# EAGLE design main (EAGLE 5.06)

## Sheet 1 of 3
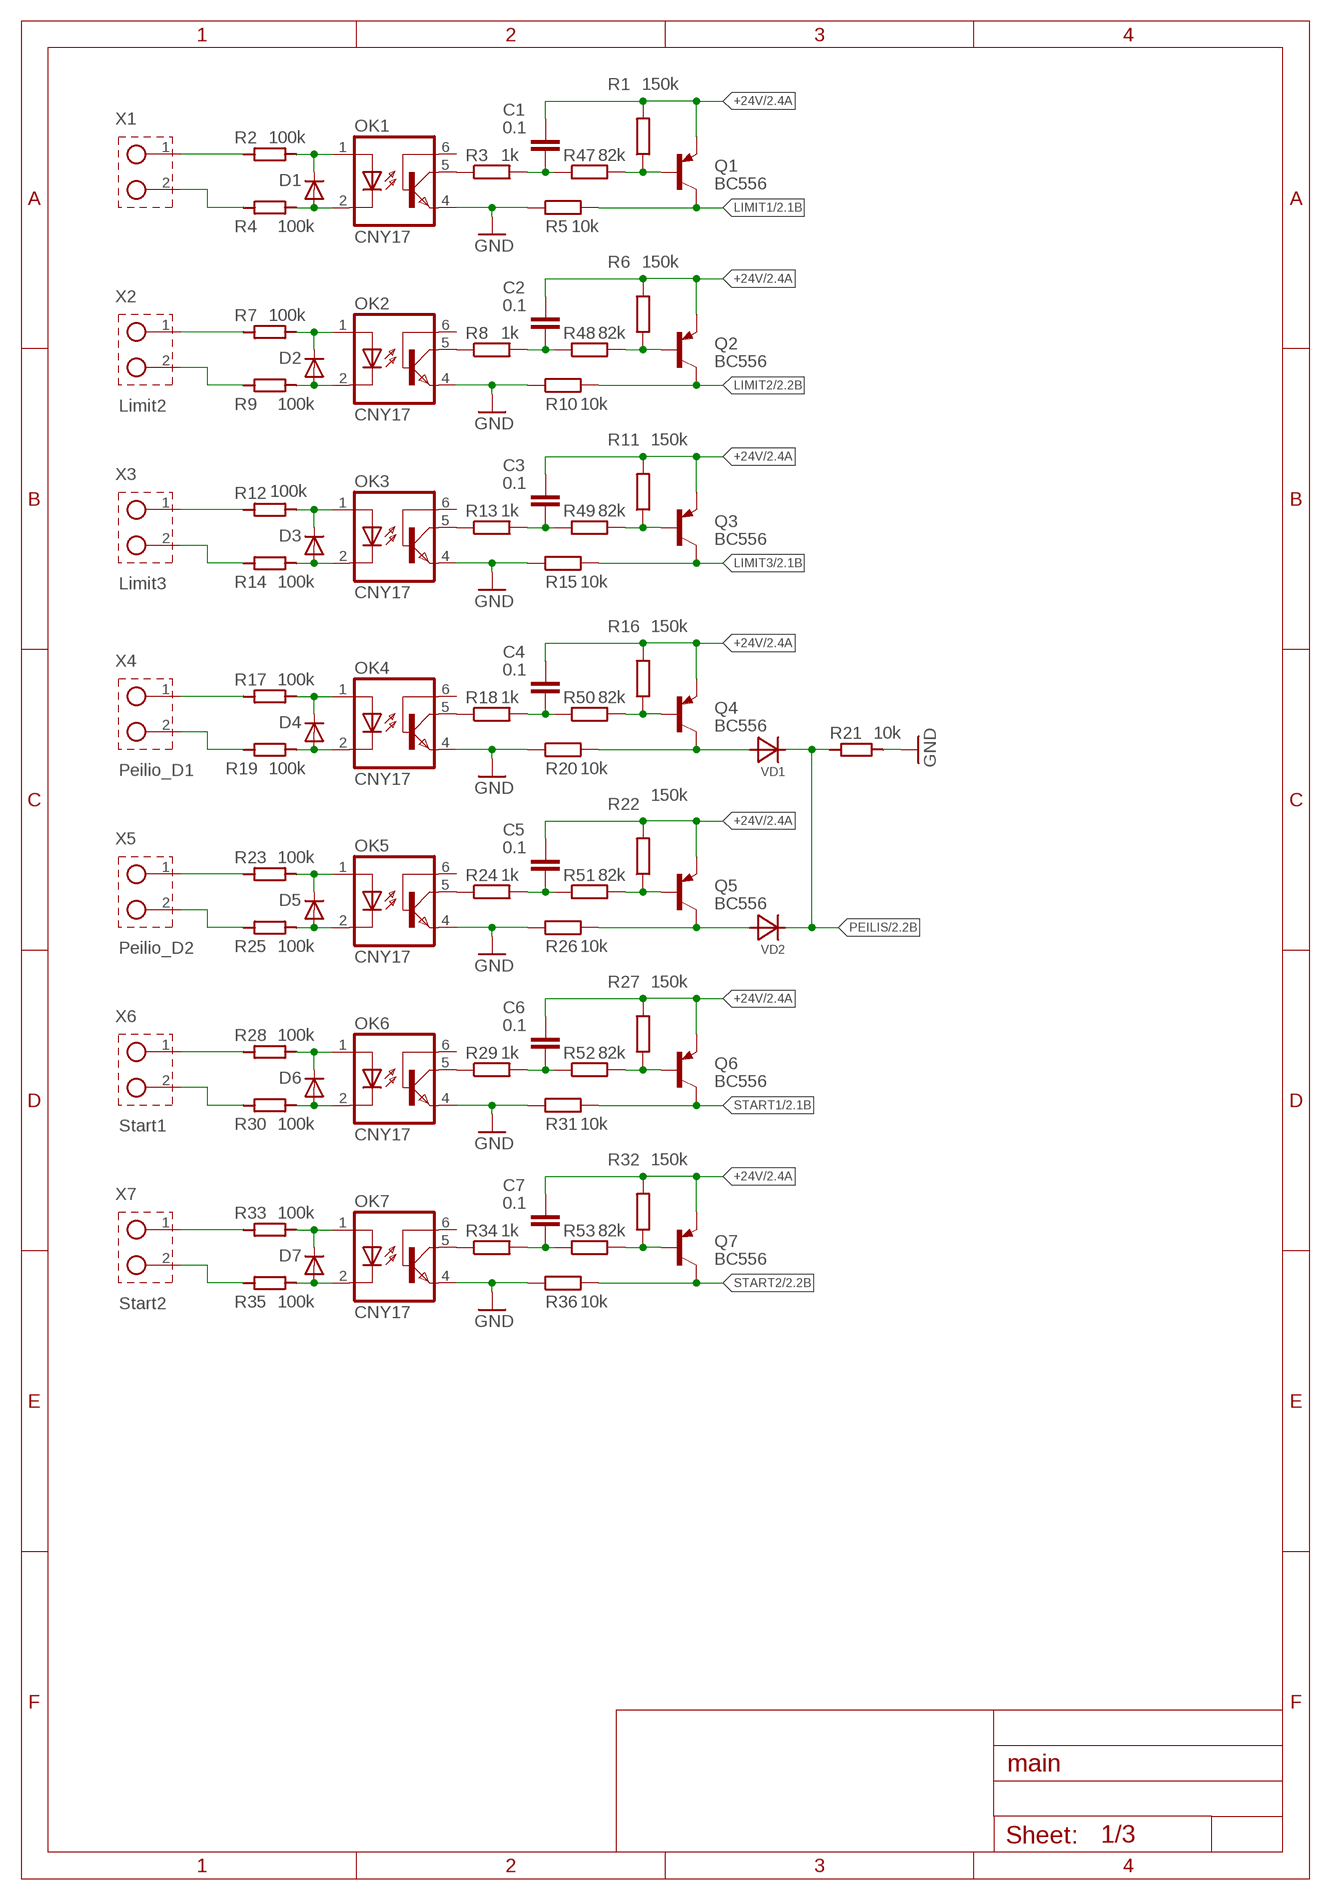
[diagram p0: schematic, sheet 1]

### Parts
C1  0.1  C-EUC0805  [C0805]
C2  0.1  C-EUC0805  [C0805]
C3  0.1  C-EUC0805  [C0805]
C4  0.1  C-EUC0805  [C0805]
C5  0.1  C-EUC0805  [C0805]
C6  0.1  C-EUC0805  [C0805]
C7  0.1  C-EUC0805  [C0805]
D1  1N4148DO35-7  DIODE-MINIMELF  [MINIMELF]
D2  1N4148DO35-7  DIODE-MINIMELF  [MINIMELF]
D3  1N4148DO35-7  DIODE-MINIMELF  [MINIMELF]
D4  1N4148DO35-7  DIODE-MINIMELF  [MINIMELF]
D5  1N4148DO35-7  DIODE-MINIMELF  [MINIMELF]
D6  1N4148DO35-7  DIODE-MINIMELF  [MINIMELF]
D7  1N4148DO35-7  DIODE-MINIMELF  [MINIMELF]
OK1  CNY17  [DIL06]
OK2  CNY17  [DIL06]
OK3  CNY17  [DIL06]
OK4  CNY17  [DIL06]
OK5  CNY17  [DIL06]
OK6  CNY17  [DIL06]
OK7  CNY17  [DIL06]
Q1  BC556  [TO92-EBC]
Q2  BC556  [TO92-EBC]
Q3  BC556  [TO92-EBC]
Q4  BC556  [TO92-EBC]
Q5  BC556  [TO92-EBC]
Q6  BC556  [TO92-EBC]
Q7  BC556  [TO92-EBC]
R1  150k  R-EU_R0805  [R0805]
R2  100k  RESISTOR0207/7  [0207/7]
R3  1k  R-EU_R0805  [R0805]
R4  100k  RESISTOR0207/7  [0207/7]
R5  10k  R-EU_R0805  [R0805]
R6  150k  R-EU_R0805  [R0805]
R7  100k  RESISTOR0207/7  [0207/7]
R8  1k  R-EU_R0805  [R0805]
R9  100k  RESISTOR0207/7  [0207/7]
R10  10k  R-EU_M0805  [M0805]
R11  150k  R-EU_R0805  [R0805]
R12  100k  RESISTOR0207/7  [0207/7]
R13  1k  R-EU_R0805  [R0805]
R14  100k  RESISTOR0207/7  [0207/7]
R15  10k  R-EU_R0805  [R0805]
R16  150k  R-EU_R0805  [R0805]
R17  100k  RESISTOR0207/7  [0207/7]
R18  1k  R-EU_R0805  [R0805]
R19  100k  RESISTOR0207/7  [0207/7]
R20  10k  R-EU_R0805  [R0805]
R21  10k  RESISTOR0805  [R0805]
R22  150k  R-EU_R0805  [R0805]
R23  100k  RESISTOR0207/7  [0207/7]
R24  1k  R-EU_R0805  [R0805]
R25  100k  RESISTOR0207/7  [0207/7]
R26  10k  R-EU_R0805  [R0805]
R27  150k  R-EU_R0805  [R0805]
R28  100k  RESISTOR0207/7  [0207/7]
R29  1k  R-EU_R0805  [R0805]
R30  100k  RESISTOR0207/7  [0207/7]
R31  10k  R-EU_R0805  [R0805]
R32  150k  R-EU_R0805  [R0805]
R33  100k  RESISTOR0207/7  [0207/7]
R34  1k  R-EU_R0805  [R0805]
R35  100k  RESISTOR0207/7  [0207/7]
R36  10k  R-EU_R0805  [R0805]
R47  82k  R-EU_M0805  [M0805]
R48  82k  R-EU_M0805  [M0805]
R49  82k  R-EU_M0805  [M0805]
R50  82k  R-EU_M0805  [M0805]
R51  82k  R-EU_M0805  [M0805]
R52  82k  R-EU_M0805  [M0805]
R53  82k  R-EU_M0805  [M0805]
VD1  DIODE_MINIMELF  [MINIMELF]
VD2  DIODE_MINIMELF  [MINIMELF]
X1  CONN-X2-W237  [W237-2]
X2  Limit2  CONN-X2-W237  [W237-2]
X3  Limit3  CONN-X2-W237  [W237-2]
X4  Peilio_D1  CONN-X2-W237  [W237-2]
X5  Peilio_D2  CONN-X2-W237  [W237-2]
X6  Start1  CONN-X2-W237  [W237-2]
X7  Start2  CONN-X2-W237  [W237-2]

### Nets
+24V: C1.1 C2.1 C3.1 C4.1 C5.1 C6.1 C7.1 Q1.E Q2.E Q3.E Q4.E Q5.E Q6.E Q7.E R1.2 R6.2 R11.2 R16.2 R22.2 R27.2 R32.2 ; also sheet 2,3
/IN1: R4.1 X1.2
/IN2: R9.1 X2.2
/IN3: R14.1 X3.2
/IN4: R19.1 X4.2
/IN5: R25.1 X5.2
/IN6: R30.1 X6.2
/IN7: R35.1 X7.2
GND: OK1.4(EMI) OK2.4(EMI) OK3.4(EMI) OK4.4(EMI) OK5.4(EMI) OK6.4(EMI) OK7.4(EMI) R5.1 R10.1 R15.1 R20.1 R21.1 R26.1 R31.1 R36.1 ; also sheet 2,3
IN1: R2.1 X1.1
IN2: R7.1 X2.1
IN3: R12.1 X3.1
IN4: R17.1 X4.1
IN5: R23.1 X5.1
IN6: R28.1 X6.1
IN7: R33.1 X7.1
LIMIT1: Q1.C R5.2 ; also sheet 2
LIMIT2: Q2.C R10.2 ; also sheet 2
LIMIT3: Q3.C R15.2 ; also sheet 2
N$1: D1.C OK1.1(A) R2.2
N$2: D2.C OK2.1(A) R7.2
N$3: OK1.5(COL) R3.1
N$4: D5.C OK5.1(A) R23.2
N$5: OK2.5(COL) R8.1
N$6: Q1.B R1.1 R47.2
N$7: Q2.B R6.1 R48.2
N$8: D3.C OK3.1(A) R12.2
N$9: OK3.5(COL) R13.1
N$10: Q3.B R11.1 R49.2
N$11: D4.C OK4.1(A) R17.2
N$12: OK4.5(COL) R18.1
N$13: Q4.B R16.1 R50.2
N$14: OK5.5(COL) R24.1
N$15: Q5.B R22.1 R51.2
N$37: D6.C OK6.1(A) R28.2
N$38: OK6.5(COL) R29.1
N$39: Q6.B R27.1 R52.2
N$40: D7.C OK7.1(A) R33.2
N$41: OK7.5(COL) R34.1
N$42: Q7.B R32.1 R53.2
N$55: D1.A OK1.2(C) R4.2
N$56: D2.A OK2.2(C) R9.2
N$57: D3.A OK3.2(C) R14.2
N$58: D4.A OK4.2(C) R19.2
N$59: D5.A OK5.2(C) R25.2
N$60: D6.A OK6.2(C) R30.2
N$61: D7.A OK7.2(C) R35.2
N$62: C1.2 R3.2 R47.1
N$63: C2.2 R8.2 R48.1
N$64: C3.2 R13.2 R49.1
N$65: C4.2 R18.2 R50.1
N$66: C6.2 R29.2 R52.1
N$67: C5.2 R24.2 R51.1
N$68: C7.2 R34.2 R53.1
PEILIO_D1: Q4.C R20.2 VD1.A
PEILIO_D2: Q5.C R26.2 VD2.A
PEILIS: R21.2 VD1.C(K) VD2.C(K) ; also sheet 2
START1: Q6.C R31.2 ; also sheet 2
START2: Q7.C R36.2 ; also sheet 2
Unconnected: OK1.6(BAS) OK2.6(BAS) OK3.6(BAS) OK4.6(BAS) OK5.6(BAS) OK6.6(BAS) OK7.6(BAS)

## Sheet 2 of 3
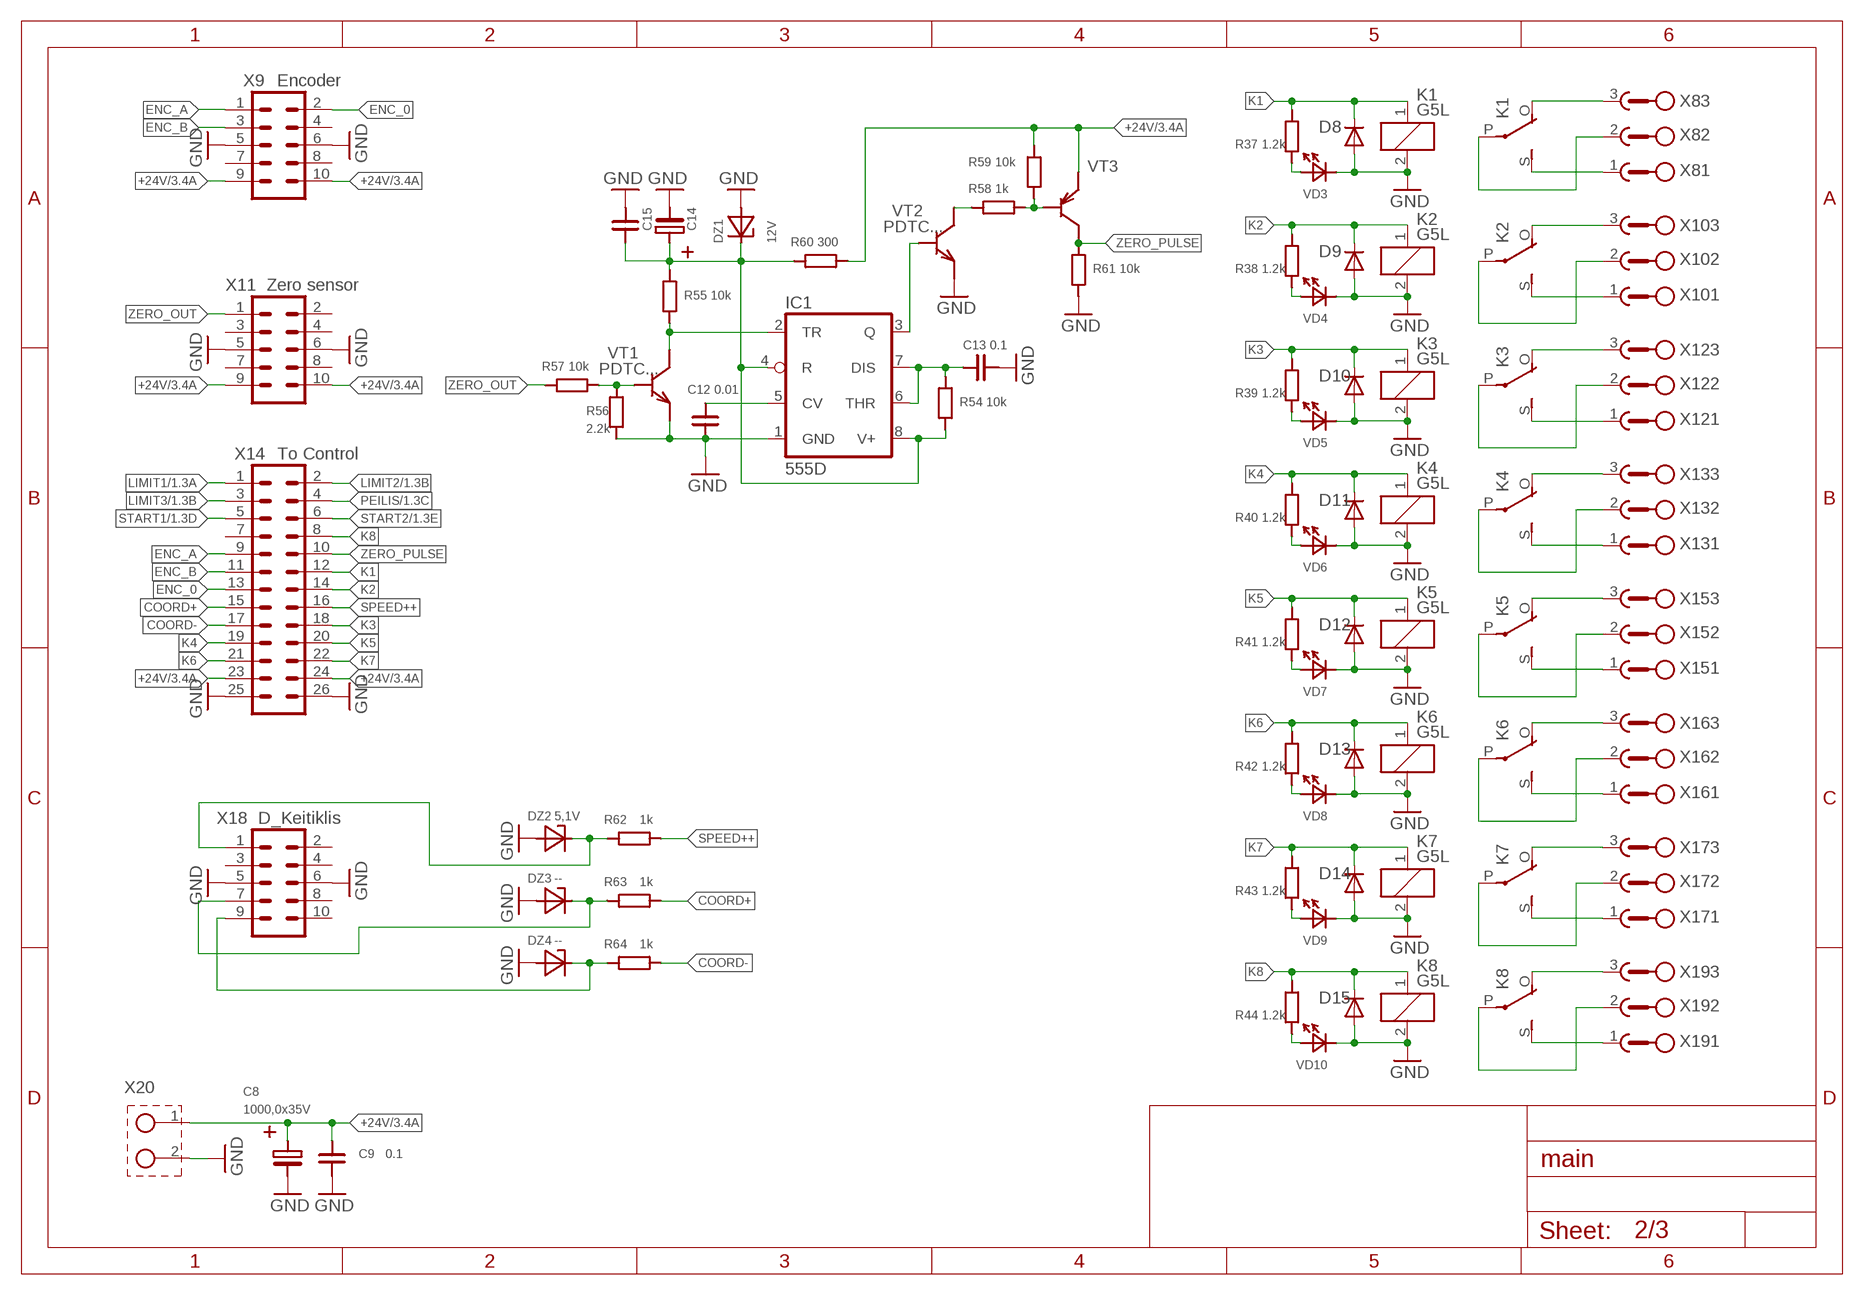
[diagram p1: schematic, sheet 2]

### Parts
C8  1000,0x35V  CAPACITOR_POL3.5/10  [E3,5-10]
C9  0.1  CAPACITOR050  [C050-025X075]
C12  0.01  CAPACITOR0805  [C0805]
C13  0.1  CAPACITOR0805  [C0805]
C14  CAPACITOR_POL0605  [153CLV-0605]
C15  CAPACITOR0805  [C0805]
D8  1N4148DO35-7  [DO35-7]
D9  1N4148DO35-7  [DO35-7]
D10  1N4148DO35-7  [DO35-7]
D11  1N4148DO35-7  [DO35-7]
D12  1N4148DO35-7  [DO35-7]
D13  1N4148DO35-7  [DO35-7]
D14  1N4148DO35-7  [DO35-7]
D15  1N4148DO35-7  [DO35-7]
DZ1  12V  ZENNER_MINIMELF  [MINIMELF]
DZ2  5,1V  ZENNER_MINIMELF  [MINIMELF]
DZ3  --  ZENNER_MINIMELF  [MINIMELF]
DZ4  --  ZENNER_MINIMELF  [MINIMELF]
IC1  555D  [SO08]
K1  G5L  [G5LE]
K2  G5L  [G5LE]
K3  G5L  [G5LE]
K4  G5L  [G5LE]
K5  G5L  [G5LE]
K6  G5L  [G5LE]
K7  G5L  [G5LE]
K8  G5L  [G5LE]
R37  1.2k  RESISTOR0805  [R0805]
R38  1.2k  RESISTOR0805  [R0805]
R39  1.2k  RESISTOR0805  [R0805]
R40  1.2k  RESISTOR0805  [R0805]
R41  1.2k  RESISTOR0805  [R0805]
R42  1.2k  RESISTOR0805  [R0805]
R43  1.2k  RESISTOR0805  [R0805]
R44  1.2k  RESISTOR0805  [R0805]
R54  10k  RESISTOR0805  [R0805]
R55  10k  RESISTOR0805  [R0805]
R56  2.2k  RESISTOR0805  [R0805]
R57  10k  RESISTOR0207/10  [0207/10]
R58  1k  RESISTOR0805  [R0805]
R59  10k  RESISTOR0805  [R0805]
R60  300  RESISTOR0805  [R0805]
R61  10k  RESISTOR0207/10  [0207/10]
R62  1k  RESISTOR0805  [R0805]
R63  1k  RESISTOR0805  [R0805]
R64  1k  RESISTOR0805  [R0805]
VD3  LED_1206  [CHIPLED_1206]
VD4  LED_1206  [CHIPLED_1206]
VD5  LED_1206  [CHIPLED_1206]
VD6  LED_1206  [CHIPLED_1206]
VD7  LED_1206  [CHIPLED_1206]
VD8  LED_1206  [CHIPLED_1206]
VD9  LED_1206  [CHIPLED_1206]
VD10  LED_1206  [CHIPLED_1206]
VT1  PDTC...  NPN-BC84*  [SOT23]
VT2  PDTC...  NPN-BC84*  [SOT23]
VT3  PNP-BC856  [SOT23]
X8  CONN-X3-TBG  [TBG-5-3]
X9  Encoder  CONN-X10-ML  [ML10]
X10  CONN-X3-TBG  [TBG-5-3]
X11  Zero sensor  CONN-X10-ML  [ML10]
X12  CONN-X3-TBG  [TBG-5-3]
X13  CONN-X3-TBG  [TBG-5-3]
X14  To Control  CONN-X26-ML  [ML26]
X15  CONN-X3-TBG  [TBG-5-3]
X16  CONN-X3-TBG  [TBG-5-3]
X17  CONN-X3-TBG  [TBG-5-3]
X18  D_Keitiklis  CONN-X10-ML  [ML10]
X19  CONN-X3-TBG  [TBG-5-3]
X20  CONN-X2-TBG  [TBG-5-2]

### Nets
+24V: C8.+ C9.2 R59.2 R60.1 VT3.2(E) X9.9 X9.10 X11.9 X11.10 X14.23 X14.24 X20.1 ; also sheet 1,3
COORD+: R63.1 X14.15
COORD-: R64.1 X14.17
ENC_0: X9.2 X14.13
ENC_A: X9.1 X14.9
ENC_B: X9.3 X14.11
GND: C8.- C9.1 C12.1 C13.2 C14.- C15.1 D8.A D9.A D10.A D11.A D12.A D13.A D14.A D15.A DZ1.A DZ2.A DZ3.A DZ4.A IC1.1(GND) K1.2 K2.2 K3.2 K4.2 K5.2 K6.2 K7.2 K8.2 R56.1 R61.1 VD3.C VD4.C VD5.C VD6.C VD7.C VD8.C VD9.C VD10.C VT1.2(E) VT2.2(E) X9.5 X9.6 X11.5 X11.6 X14.25 X14.26 X18.5 X18.6 X20.2 ; also sheet 1,3
K1: D8.C K1.1 R37.2 X14.12
K2: D9.C K2.1 R38.2 X14.14
K3: D10.C K3.1 R39.2 X14.18
K4: D11.C K4.1 R40.2 X14.19
K5: D12.C K5.1 R41.2 X14.20
K6: D13.C K6.1 R42.2 X14.21
K7: D14.C K7.1 R43.2 X14.22
K8: D15.C K8.1 R44.2 X14.8
LIMIT1: X14.1 ; also sheet 1
LIMIT2: X14.2 ; also sheet 1
LIMIT3: X14.3 ; also sheet 1
N$16: K1.S(2:S) X8.1
N$17: K1.O(2:O) X8.3
N$18: K1.P(2:P) X8.2
N$19: K2.O(2:O) X10.3
N$20: K2.S(2:S) X10.1
N$21: K2.P(2:P) X10.2
N$22: K3.O(2:O) X12.3
N$23: K3.S(2:S) X12.1
N$24: K3.P(2:P) X12.2
N$25: K6.O(2:O) X16.3
N$26: K6.S(2:S) X16.1
N$27: K5.P(2:P) X15.2
N$28: K5.O(2:O) X15.3
N$29: K5.S(2:S) X15.1
N$30: K6.P(2:P) X16.2
N$31: K7.O(2:O) X17.3
N$32: K7.S(2:S) X17.1
N$33: K7.P(2:P) X17.2
N$34: K8.O(2:O) X19.3
N$35: K8.S(2:S) X19.1
N$36: K8.P(2:P) X19.2
N$43: K4.O(2:O) X13.3
N$44: K4.S(2:S) X13.1
N$45: K4.P(2:P) X13.2
N$47: R37.1 VD3.A
N$48: R38.1 VD4.A
N$49: R39.1 VD5.A
N$50: R40.1 VD6.A
N$51: R41.1 VD7.A
N$52: R42.1 VD8.A
N$53: R43.1 VD9.A
N$54: R44.1 VD10.A
N$69: C13.1 IC1.6(THR) IC1.7(DIS) R54.2
N$70: C14.+ C15.2 DZ1.C IC1.4(R) IC1.8(V+) R54.1 R55.2 R60.2
N$71: R56.2 R57.1 VT1.1(B)
N$72: IC1.2(TR) R55.1 VT1.3(C)
N$73: C12.2 IC1.5(CV)
N$74: IC1.3(Q) VT2.1(B)
N$75: R58.2 VT2.3(C)
N$76: R58.1 R59.1 VT3.1(B)
N$77: DZ2.C R62.2 X18.1
N$78: DZ3.C R63.2 X18.7
N$79: DZ4.C R64.2 X18.9
PEILIS: X14.4 ; also sheet 1
SPEED++: R62.1 X14.16
START1: X14.5 ; also sheet 1
START2: X14.6 ; also sheet 1
ZERO_OUT: R57.2 X11.1
ZERO_PULSE: R61.2 VT3.3(C) X14.10
Unconnected: X9.4 X9.7 X9.8 X11.2 X11.3 X11.4 X11.7 X11.8 X14.7 X18.2 X18.3 X18.4 X18.8 X18.10

## Sheet 3 of 3
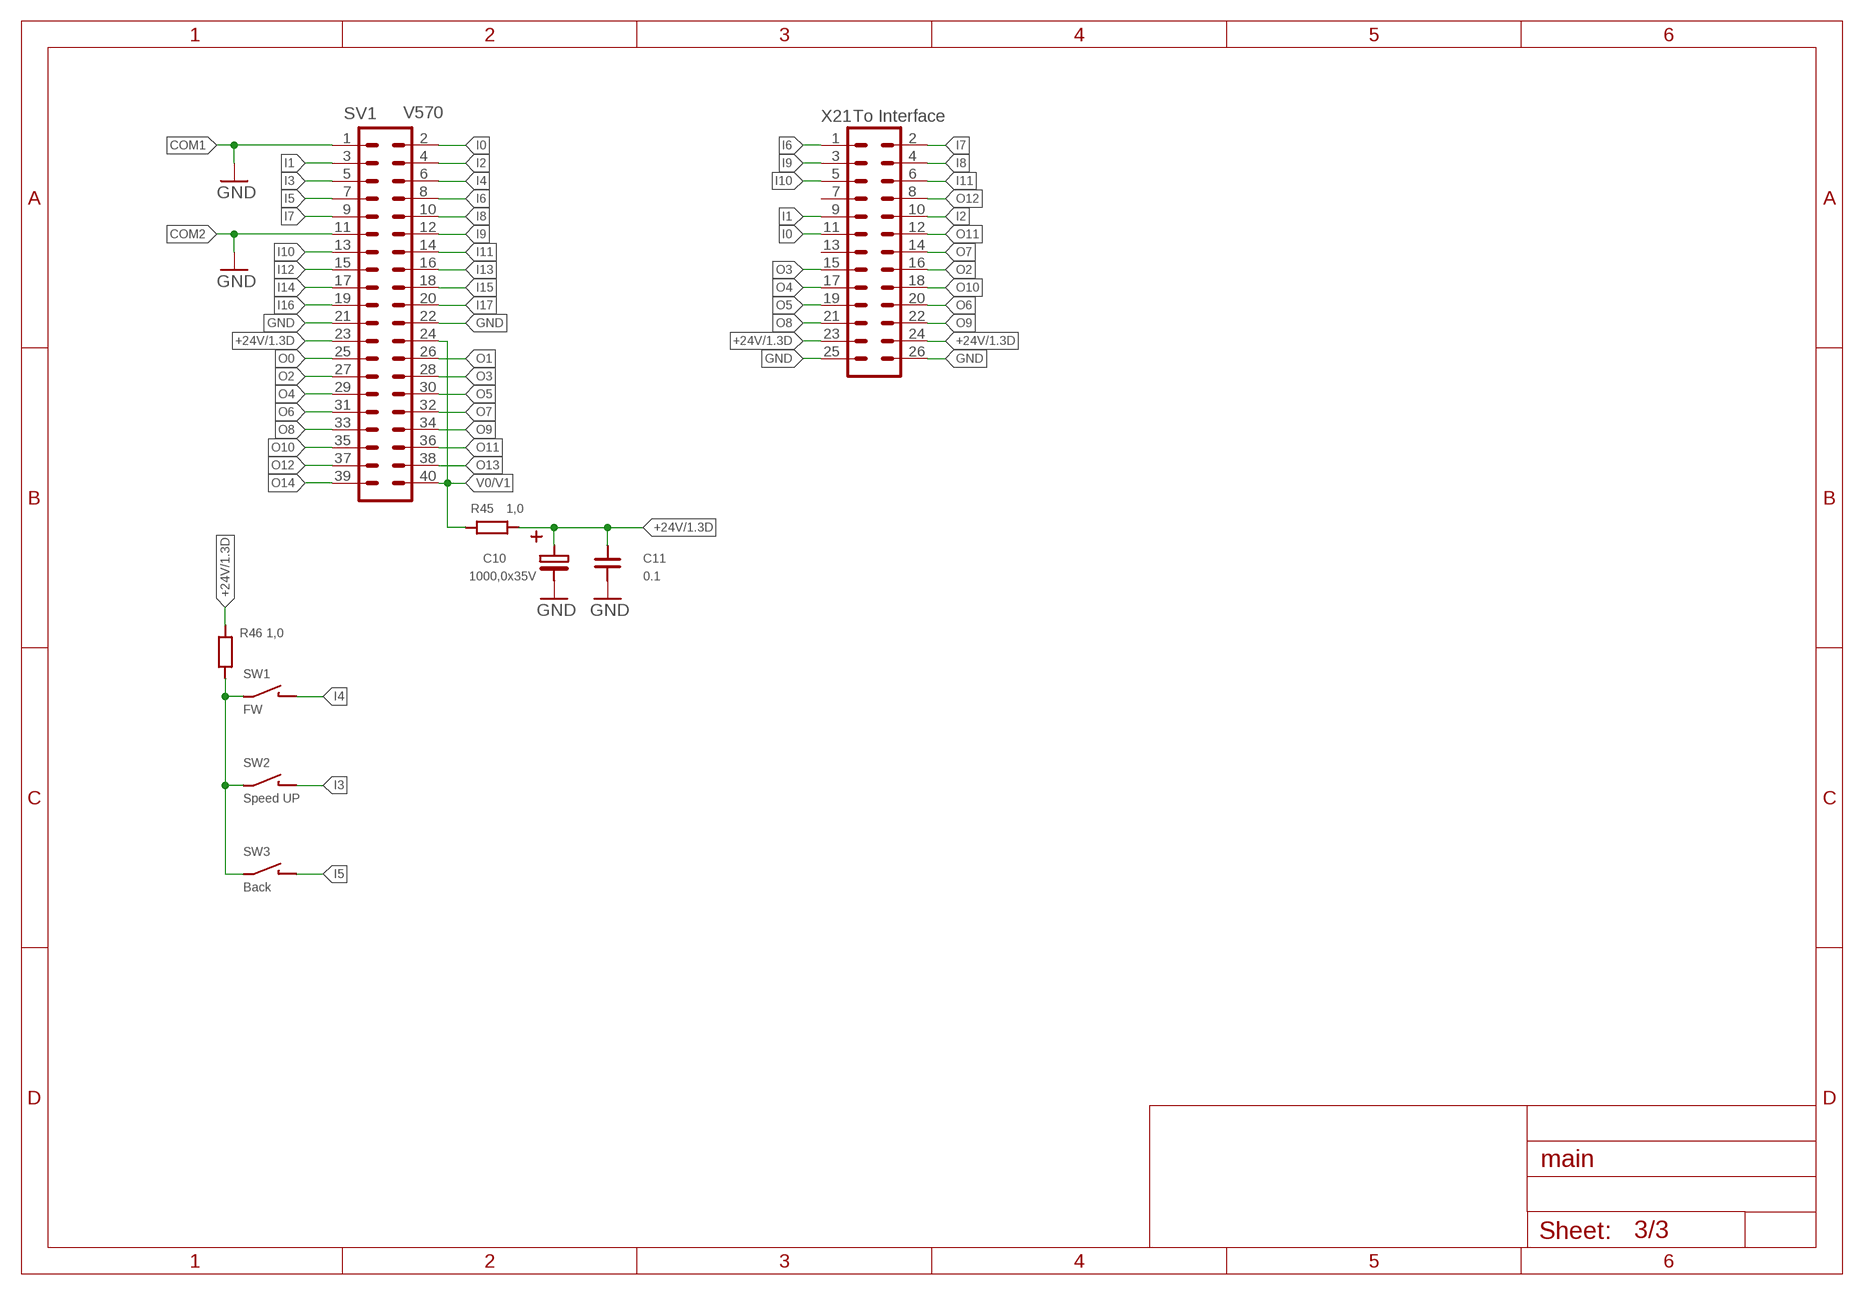
[diagram p2: schematic, sheet 3]

### Parts
C10  1000,0x35V  CAPACITOR_POL3.5/10  [E3,5-10]
C11  0.1  CAPACITOR050  [C050-025X075]
R45  1,0  RESISTOR0207/10  [0207/10]
R46  1,0  RESISTOR0207/10  [0207/10]
SV1  V570  ML40  [ML40]
SW1  FW  BUTTON1-ITW  [ITW]
SW2  Speed UP  BUTTON1-ITW  [ITW]
SW3  Back  BUTTON1-ITW  [ITW]
X21  To Interface  CONN-X26-ML  [ML26]

### Nets
+24V: C10.+ C11.2 R45.2 R46.2 SV1.23 X21.23 X21.24 ; also sheet 1,2
COM1: SV1.1 ; supply symbol labelled GND
COM2: SV1.11 ; supply symbol labelled GND
GND: C10.- C11.1 SV1.21 SV1.22 X21.25 X21.26 ; also sheet 1,2
I0: SV1.2 X21.11
I1: SV1.3 X21.9
I2: SV1.4 X21.10
I3: SV1.5 SW2.2
I4: SV1.6 SW1.2
I5: SV1.7 SW3.2
I6: SV1.8 X21.1
I7: SV1.9 X21.2
I8: SV1.10 X21.4
I9: SV1.12 X21.3
I10: SV1.13 X21.5
I11: SV1.14 X21.6
I12: SV1.15
I13: SV1.16
I14: SV1.17
I15: SV1.18
I16: SV1.19
I17: SV1.20
N$46: R46.1 SW1.1 SW2.1 SW3.1
O0: SV1.25
O1: SV1.26
O2: SV1.27 X21.16
O3: SV1.28 X21.15
O4: SV1.29 X21.17
O5: SV1.30 X21.19
O6: SV1.31 X21.20
O7: SV1.32 X21.14
O8: SV1.33 X21.21
O9: SV1.34 X21.22
O10: SV1.35 X21.18
O11: SV1.36 X21.12
O12: SV1.37 X21.8
O13: SV1.38
O14: SV1.39
V0/V1: R45.1 SV1.24 SV1.40
Unconnected: X21.7 X21.13

## Library data of the parts
C1-C7 = rcl:C-EU: CAPACITOR, European symbol
C8 C10 C14 = rcl:CAPACITOR_POL
C9 C11-C13 C15 = rcl:CAPACITOR
D1-D7 = diode:DIODE-: DIODE
D8-D15 = diode:1N4148: DIODE high speed (Philips)
DZ1-DZ4 = diode:ZENNER
IC1 = ic:555
K1-K8 = relay:G5L: RELAY 1 x switch, 10 A/120 V AC, 8 A/30 V ADC, Omron
OK1-OK7 = optocoupler:CNY17: SIEMENS OPTO COUPLER
Q1-Q7 = transistor-pnp:BC556*: PNP Transistror
R1 R3 R5 R6 R8 R10 R11 R13 R15 R16 R18 R20 R22 R24 R26 R27 R29 R31 R32 R34 R36 R47-R53 = rcl:R-EU_: RESISTOR, European symbol
R2 R4 R7 R9 R12 R14 R17 R19 R21 R23 R25 R28 R30 R33 R35 R37-R46 R54-R64 = rcl:RESISTOR
SV1 = connectors:ML40: HARTING
SW1-SW3 = switches:BUTTON1
VD1 VD2 = diode:DIODE
VD3-VD10 = optic:LED
VT1 VT2 = semi:NPN
VT3 = semi:PNP: Datasheet: http://www.smd.ru/files/upload/1253/ru/bc856_bc857_bc858_4.pdf; ICO: 100 mA; MARKING: 3D, 3A; VCEO: 65V
X1-X7 = connectors:CONN-X2: PHOENIX; STEP: 5.00 mm
X8 X10 X12 X13 X15-X17 X19 = connectors:CONN-X3; STEP: 5.08 mm
X9 X11 X18 = connectors:CONN-X10
X14 X21 = connectors:CONN-X26
X20 = connectors:CONN-X2: PHOENIX; STEP: 5.08 mm

## Net classes
1 power: clearance 0.406 mm

## Board
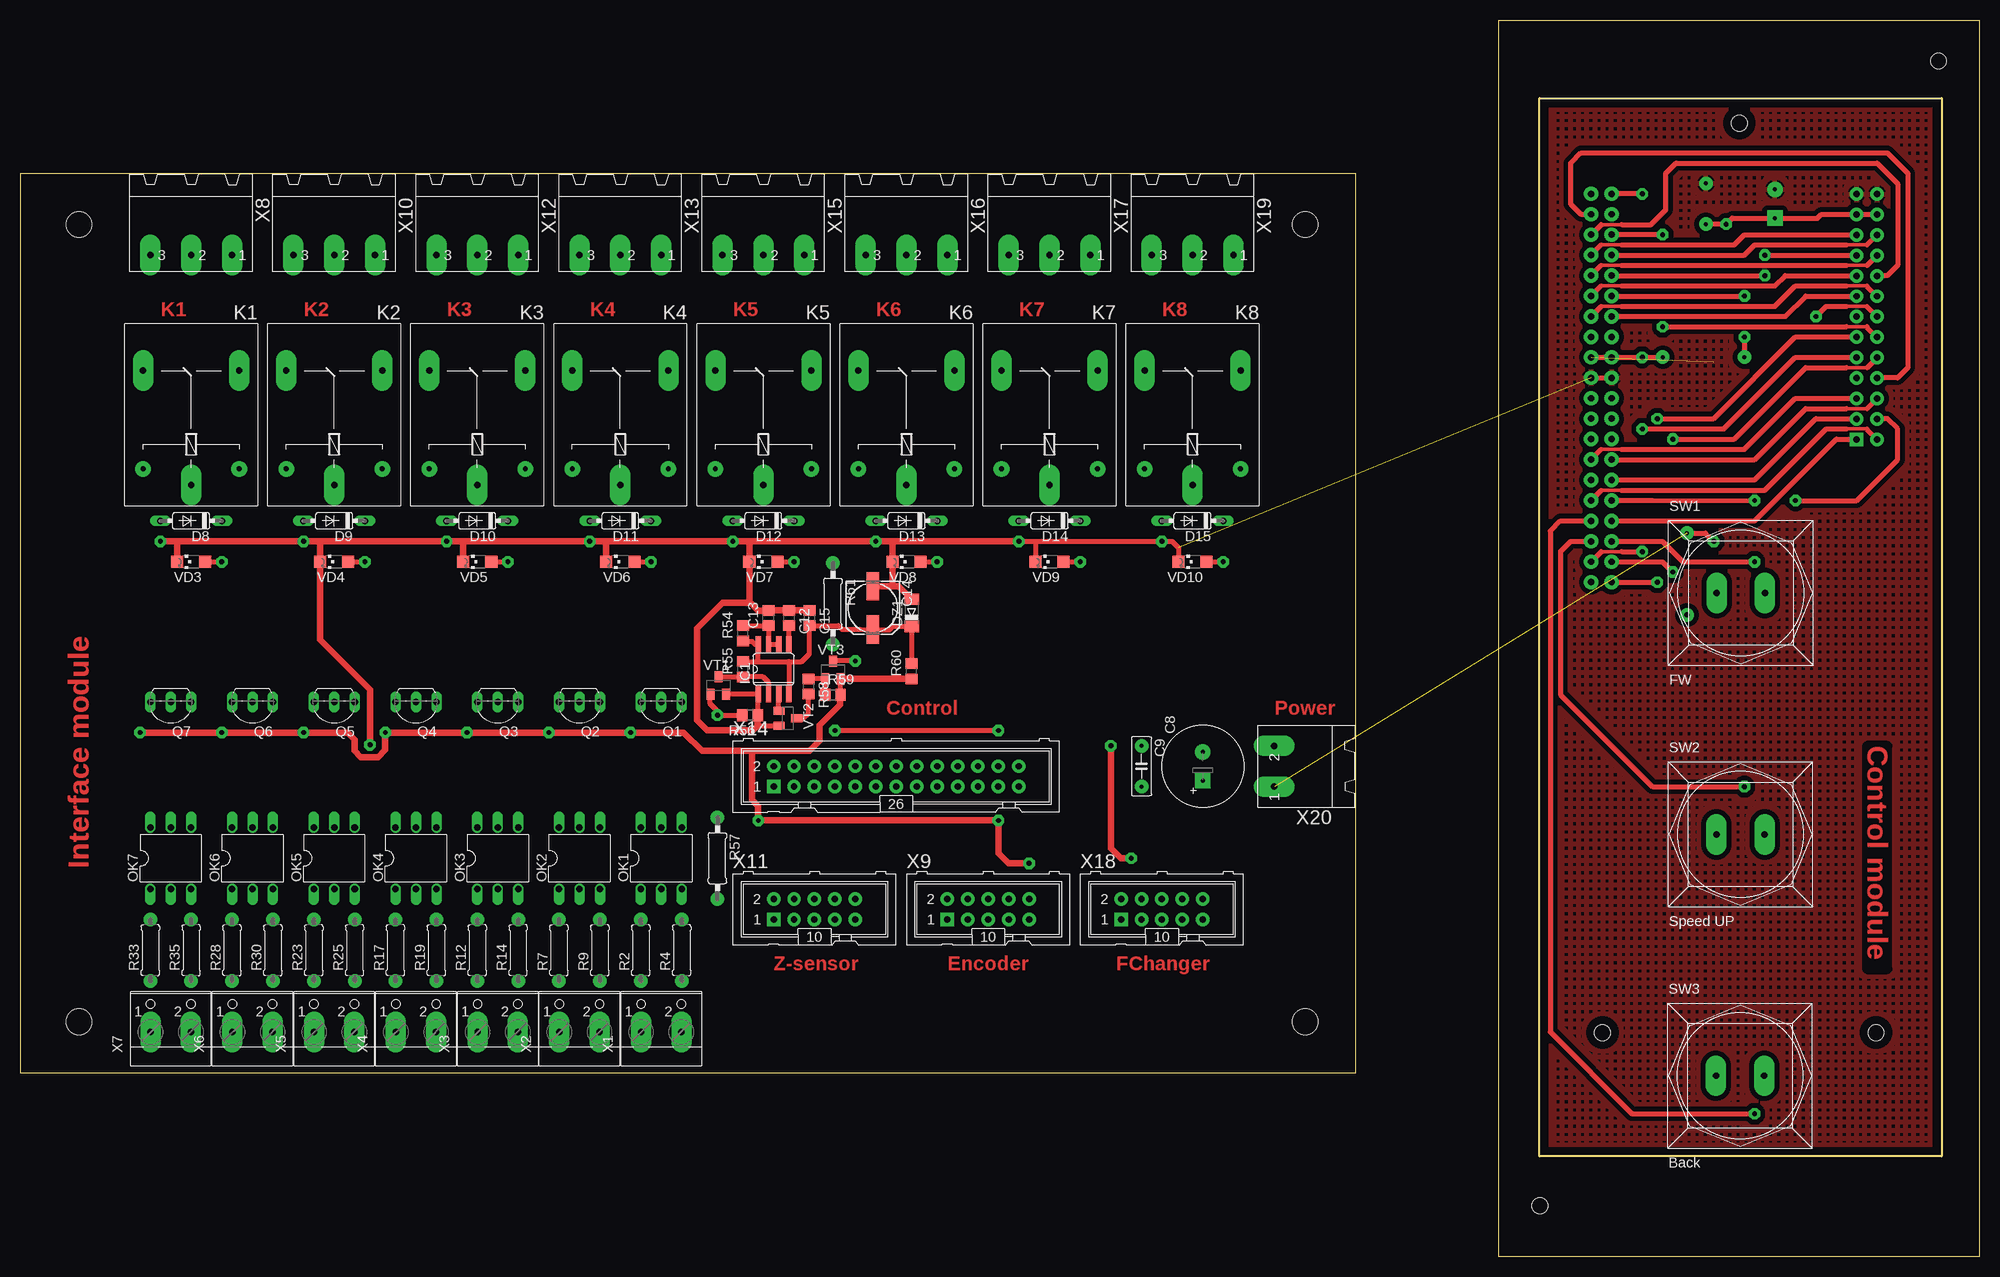
[diagram p3: board, top side]
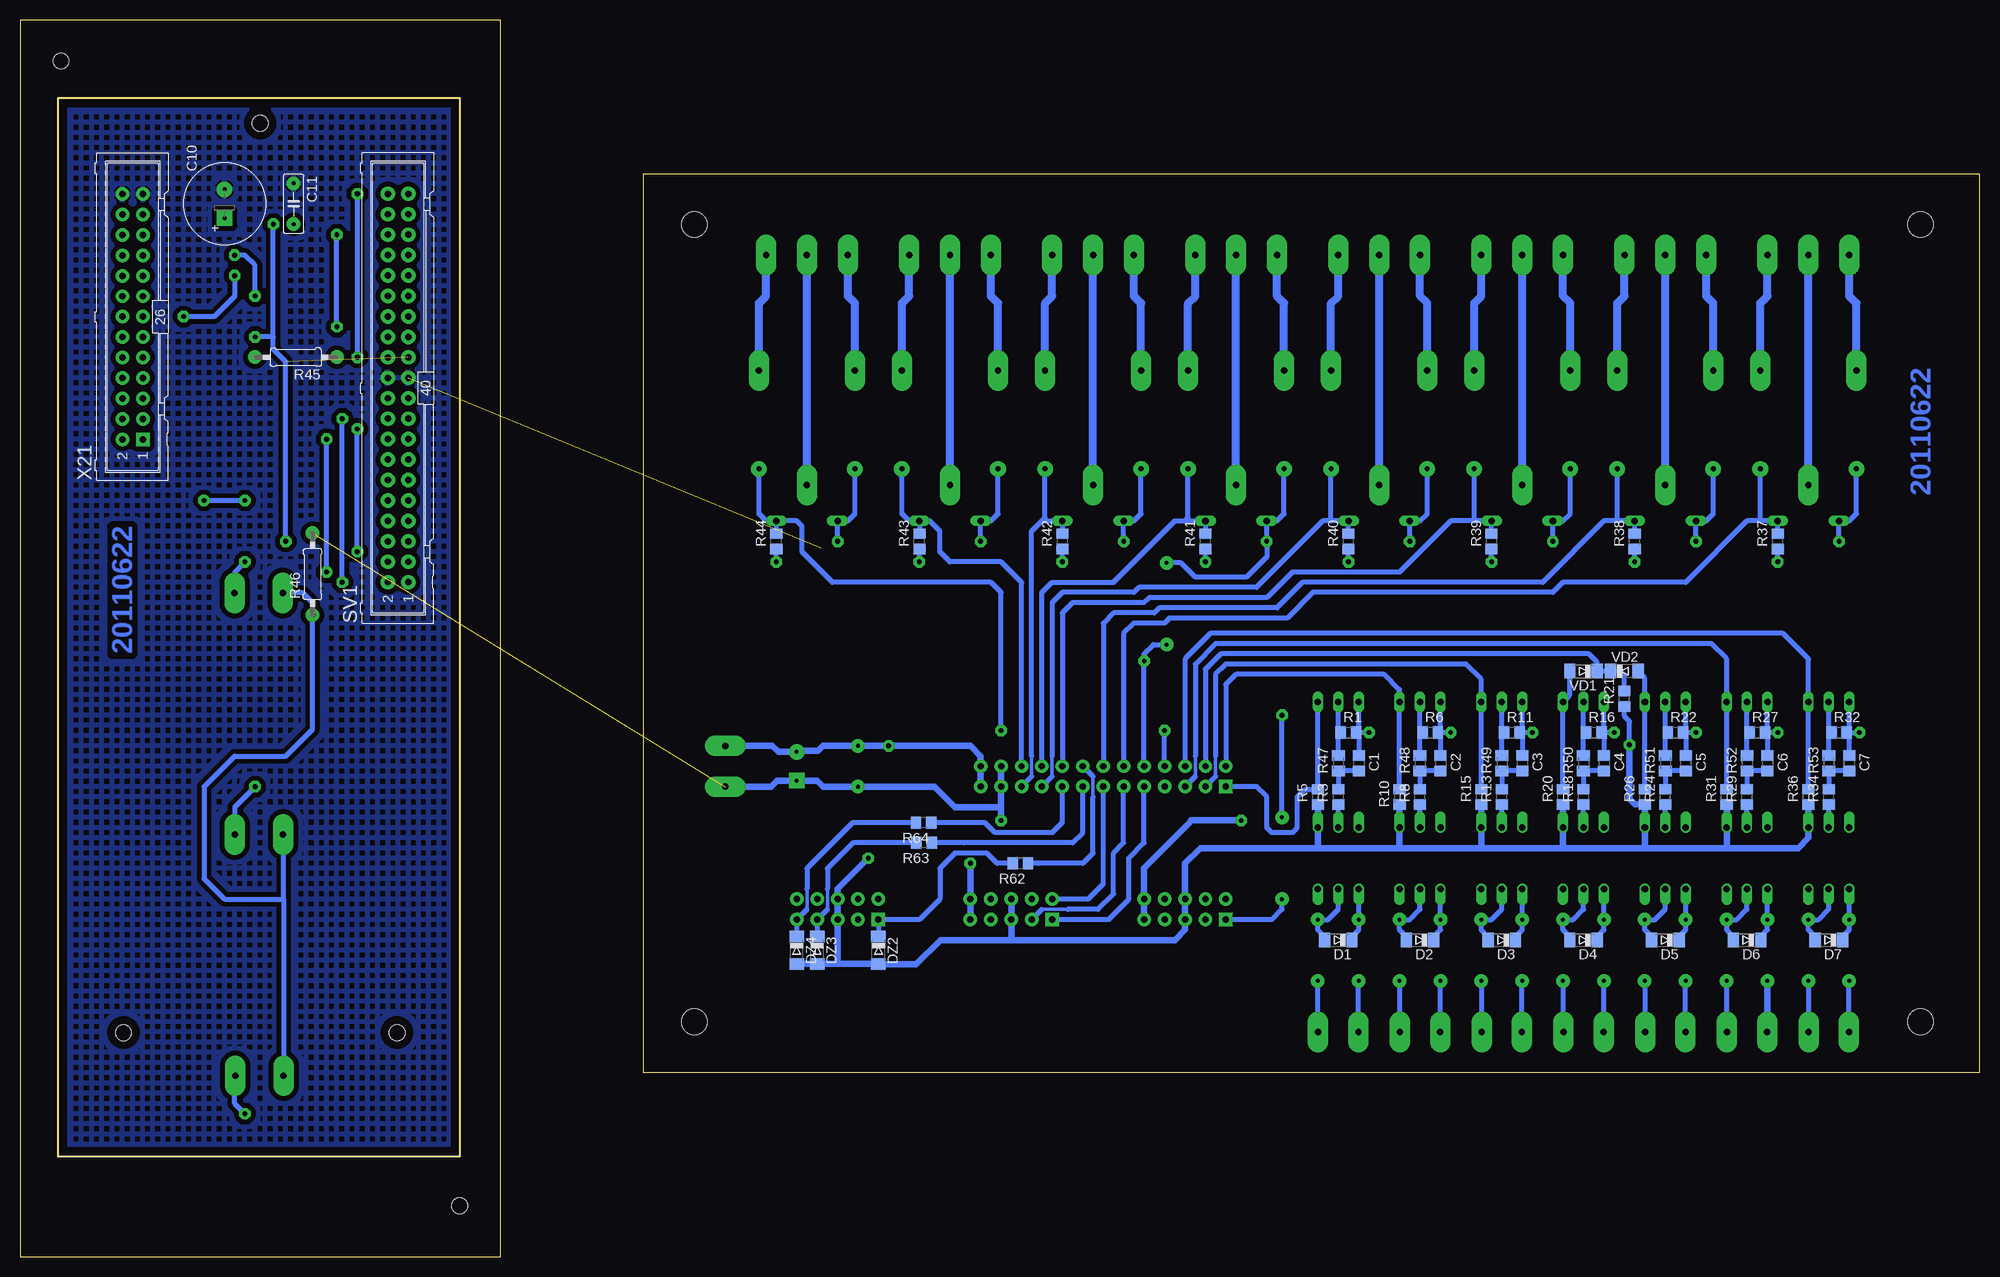
[diagram p4: board, bottom side, seen from below]

Size 243.51 x 153.67 mm. Coordinates in mm from the lower left corner, seen from the top.
Outline: 166.04,22.86 166.04,134.6 0,134.6 0,22.86 166.04,22.86
Outline: 188.83,143.98 238.83,143.98 238.83,12.48 188.83,12.48 188.83,143.98
Outline: 183.82,153.67 243.51,153.67 243.51,0 183.82,0 183.82,153.67
Copper layers (1*16): Top 0.035mm / dielectric 1.5mm / Bottom 0.035mm
Design rules "default *": minimum track width 10mil, minimum drill 24mil, track to track 8mil, track to pad 8mil, pad to pad 8mil, via to via 8mil, smd to smd 8mil, copper to edge 40mil, drill to drill 8mil, minimum pad ring 10mil, minimum via ring 8mil, stop-mask expansion 4mil, vias tented up to drill 0mil, thermal gap 10mil
Holes 3.2 mm at 7.29,29.21 7.29,128.27 159.69,128.27 159.69,29.21
Holes 2 mm at 238.43,148.59 188.9,6.35 196.67,27.86 230.67,27.86 213.67,140.86

### Footprints (pad centres in the part's own frame; a part is rotated, then mirrored left to right if it is on the bottom)
C0805 = smd 1.3 x 1.5: 1 -0.95,0; 2 0.95,0
E3,5-10 = drill 0.5 pad 1.93 square: + -1.778,0 | drill 0.5 pad 1.93 round: - 1.778,0
C050-025X075 = drill 0.5 pad 1.676 round: 1 -2.54,0; 2 2.54,0
153CLV-0605 = smd 3.5 x 1.6: + 2.7,0; - -2.7,0
MINIMELF = smd 1.4 x 1.8: A 1.7,0; C -1.7,0
DO35-7 = drill 0.813 long: A 3.81,0; C -3.81,0
SO08 = smd 0.66 x 2.032: 1 -1.905,-3.073; 2 -0.635,-3.073; 3 0.635,-3.073; 4 1.905,-3.073; 5 1.905,3.073; 6 0.635,3.073; 7 -0.635,3.073; 8 -1.905,3.073
G5LE = drill 0.6 pad 1.93 round: 1 -7.493,-5.969; 2 -7.493,5.969 | drill 0.8 pad 2.54 long: O 4.699,5.969; P -9.525,0; S 4.699,-5.969
DIL06 = drill 0.813 offset: 1 -2.54,-3.81; 2 0,-3.81; 3 2.54,-3.81; 4 2.54,3.81; 5 0,3.81; 6 -2.54,3.81
TO92-EBC = drill 0.813 long: B 0,-1.27; C -2.54,-1.27; E 2.54,-1.27
R0805 = smd 1.3 x 1.5: 1 -0.95,0; 2 0.95,0
0207/7 = drill 0.5 pad 1.676 round: 1 -3.81,0; 2 3.81,0
M0805 = smd 1.3 x 1.6: 1 -0.95,0; 2 0.95,0
0207/10 = drill 0.5 pad 1.676 round: 1 -5.08,0; 2 5.08,0
ML40 = drill 0.8 pad 1.778 round: 1 -24.13,-1.27; 2 -24.13,1.27; 3 -21.59,-1.27; 4 -21.59,1.27; 5 -19.05,-1.27; 6 -19.05,1.27; 7 -16.51,-1.27; 8 -16.51,1.27; 9 -13.97,-1.27; 10 -13.97,1.27; 11 -11.43,-1.27; 12 -11.43,1.27; 13 -8.89,-1.27; 14 -8.89,1.27; 15 -6.35,-1.27; 16 -6.35,1.27; 17 -3.81,-1.27; 18 -3.81,1.27; 19 -1.27,-1.27; 20 -1.27,1.27; 21 1.27,-1.27; 22 1.27,1.27; 23 3.81,-1.27; 24 3.81,1.27; 25 6.35,-1.27; 26 6.35,1.27; 27 8.89,-1.27; 28 8.89,1.27; 29 11.43,-1.27; 30 11.43,1.27; 31 13.97,-1.27; 32 13.97,1.27; 33 16.51,-1.27; 34 16.51,1.27; 35 19.05,-1.27; 36 19.05,1.27; 37 21.59,-1.27; 38 21.59,1.27; 39 24.13,-1.27; 40 24.13,1.27
ITW = drill 0.8 pad 2.54 long: 1 -3,0; 2 3,0
CHIPLED_1206 = smd 1.5 x 1.5: A 0,-1.75; C 0,1.75
SOT23 = smd 1 x 1.4: 1 -0.95,-1.1; 2 0.95,-1.1; 3 0,1.1
W237-2 = drill 0.8 pad 2.54 long: 1 -2.5,-1.27; 2 2.5,-1.27
TBG-5-3 = drill 0.8 pad 2.54 long: 1 -5.08,3.81; 2 0,3.81; 3 5.08,3.81
ML10 = drill 0.8 pad 1.676 square: 1 -5.08,-1.27 | drill 0.8 pad 1.676 round: 2 -5.08,1.27; 3 -2.54,-1.27; 4 -2.54,1.27; 5 0,-1.27; 6 0,1.27; 7 2.54,-1.27; 8 2.54,1.27; 9 5.08,-1.27; 10 5.08,1.27
ML26 = drill 0.8 pad 1.676 square: 1 -15.24,-1.27 | drill 0.8 pad 1.676 round: 2 -15.24,1.27; 3 -12.7,-1.27; 4 -12.7,1.27; 5 -10.16,-1.27; 6 -10.16,1.27; 7 -7.62,-1.27; 8 -7.62,1.27; 9 -5.08,-1.27; 10 -5.08,1.27; 11 -2.54,-1.27; 12 -2.54,1.27; 13 0,-1.27; 14 0,1.27; 15 2.54,-1.27; 16 2.54,1.27; 17 5.08,-1.27; 18 5.08,1.27; 19 7.62,-1.27; 20 7.62,1.27; 21 10.16,-1.27; 22 10.16,1.27; 23 12.7,-1.27; 24 12.7,1.27; 25 15.24,-1.27; 26 15.24,1.27
TBG-5-2 = drill 0.8 pad 2.54 long: 1 -2.54,3.81; 2 2.54,3.81

### Placement (x,y rotation side)
C1  77.14,61.34 270 bottom
C2  66.98,61.34 270 bottom
C3  56.82,61.34 270 bottom
C4  46.66,61.34 270 bottom
C5  36.5,61.34 270 bottom
C6  26.34,61.34 270 bottom
C7  16.18,61.34 270 bottom
C8  146.99,60.96 90 top
C9  139.37,60.96 270 top
C10  218.1,130.85 90 bottom
C11  209.52,130.85 270 bottom
C12  95.56,79.38 270 top
C13  93.02,79.38 90 top
C14  105.97,80.64 270 top
C15  98.09,79.38 270 top
D1  79.68,39.37 180 bottom
D2  69.52,39.37 180 bottom
D3  59.36,39.37 180 bottom
D4  49.2,39.37 180 bottom
D5  39.04,39.37 180 bottom
D6  28.88,39.37 180 bottom
D7  18.72,39.37 180 bottom
D8  21.26,91.44 180 top
D9  39.04,91.44 180 top
D10  56.82,91.44 180 top
D11  74.6,91.44 180 top
D12  92.38,91.44 180 top
D13  110.16,91.44 180 top
D14  127.94,91.44 180 top
D15  145.72,91.44 180 top
DZ1  110.8,80.01 90 top
DZ2  136.83,38.1 270 bottom
DZ3  144.45,38.1 270 bottom
DZ4  146.99,38.1 270 bottom
IC1  93.65,73.03 0 top
K1  21.26,105.41 90 top
K2  39.04,105.41 90 top
K3  56.82,105.41 90 top
K4  74.6,105.41 90 top
K5  92.38,105.41 90 top
K6  110.16,105.41 90 top
K7  127.94,105.41 90 top
K8  145.72,105.41 90 top
OK1  79.68,49.53 0 top
OK2  69.52,49.53 0 top
OK3  59.36,49.53 0 top
OK4  49.2,49.53 0 top
OK5  39.04,49.53 0 top
OK6  28.88,49.53 0 top
OK7  18.72,49.53 0 top
Q1  79.68,67.69 180 top
Q2  69.52,67.69 180 top
Q3  59.36,67.69 180 top
Q4  49.2,67.69 180 top
Q5  39.04,67.69 180 top
Q6  28.88,67.69 180 top
Q7  18.72,67.69 180 top
R1  78.41,65.15 0 bottom
R2  77.14,38.1 90 top
R3  79.68,57.15 90 bottom
R4  82.22,38.1 90 top
R5  82.22,57.15 90 bottom
R6  68.25,65.15 0 bottom
R7  66.98,38.1 90 top
R8  69.52,57.15 90 bottom
R9  72.06,38.1 90 top
R10  72.06,57.15 90 bottom
R11  58.09,65.15 0 bottom
R12  56.82,38.1 90 top
R13  59.36,57.15 90 bottom
R14  61.9,38.1 90 top
R15  61.9,57.15 90 bottom
R16  47.93,65.15 0 bottom
R17  46.66,38.1 90 top
R18  49.2,57.15 90 bottom
R19  51.74,38.1 90 top
R20  51.74,57.15 90 bottom
R21  44.12,69.34 90 bottom
R22  37.77,65.15 0 bottom
R23  36.5,38.1 90 top
R24  39.04,57.15 90 bottom
R25  41.58,38.1 90 top
R26  41.58,57.15 90 bottom
R27  27.61,65.15 0 bottom
R28  26.34,38.1 90 top
R29  28.88,57.15 90 bottom
R30  31.42,38.1 90 top
R31  31.42,57.15 90 bottom
R32  17.45,65.15 0 bottom
R33  16.18,38.1 90 top
R34  18.72,57.15 90 bottom
R35  21.26,38.1 90 top
R36  21.26,57.15 90 bottom
R37  25.07,88.9 90 bottom
R38  42.85,88.9 90 bottom
R39  60.63,88.9 90 bottom
R40  78.41,88.9 90 bottom
R41  96.19,88.9 90 bottom
R42  113.97,88.9 90 bottom
R43  131.75,88.9 90 bottom
R44  149.53,88.9 90 bottom
R45  209.24,111.79 180 bottom
R46  207.17,84.84 90 bottom
R47  79.68,61.34 90 bottom
R48  69.52,61.34 90 bottom
R49  59.36,61.34 90 bottom
R50  49.2,61.34 90 bottom
R51  39.04,61.34 90 bottom
R52  28.88,61.34 90 bottom
R53  18.72,61.34 90 bottom
R54  89.84,77.47 90 top
R55  89.84,73.03 90 top
R56  90.73,67.31 180 top
R57  86.67,49.53 270 top
R58  97.97,70.87 270 top
R59  101.02,69.85 0 top
R60  110.8,72.77 90 top
R61  101.02,81.15 270 top
R62  119.2,48.88 180 bottom
R63  131.17,51.44 180 bottom
R64  131.21,53.94 180 bottom
SV1  196.53,107.96 90 bottom
SW1  213.87,82.5 0 top
SW2  213.82,52.5 0 top
SW3  213.77,22.5 0 top
VD1  49.2,72.77 180 bottom
VD2  44.12,72.77 0 bottom
VD3  21.26,86.36 90 top
VD4  39.04,86.36 90 top
VD5  56.82,86.36 90 top
VD6  74.6,86.36 90 top
VD7  92.38,86.36 90 top
VD8  110.16,86.36 90 top
VD9  127.94,86.36 90 top
VD10  145.72,86.36 90 top
VT1  86.79,70.99 0 top
VT2  95.43,66.93 270 top
VT3  101.02,72.9 0 top
X1  79.68,29.21 0 top
X2  69.52,29.21 0 top
X3  59.36,29.21 0 top
X4  49.2,29.21 0 top
X5  39.04,29.21 0 top
X6  28.88,29.21 0 top
X7  18.72,29.21 0 top
X8  21.26,128.27 180 top
X9  120.32,43.18 0 top
X10  39.04,128.27 180 top
X11  98.73,43.18 0 top
X12  56.82,128.27 180 top
X13  74.6,128.27 180 top
X14  108.89,59.69 0 top
X15  92.38,128.27 180 top
X16  110.16,128.27 180 top
X17  127.94,128.27 180 top
X18  141.91,43.18 0 top
X19  145.72,128.27 180 top
X20  159.69,60.96 90 top
X21  229.53,116.82 90 bottom

### Tracks (layer width: path | path; a pad name or v marks a point on that pad's centre or on a via)
+24V  (via drill 0.6 pad 1.42)  (2 unrouted)
  Top 0.61: R59.2 VT3.2 | X21.24 X21.23 223.89,129.52 223.39,129.02 218.15,129.02 C10.+ 212.79,129.07 v212.03,128.31 209.94,128.31 C11.2 | R46.2 209.47,89.92 v210.49,88.9 | 214.29,111.76 R45.2 214.32,114.28 v214.3,114.3
  Top 0.813: v14.91,65.15 v25.07,65.15 v35.23,65.15 40.69,65.15 41.58,64.26 41.58,62.87 42.34,62.1 44.5,62.1 45.39,62.99 v45.39,65.15 v55.55,65.15 v65.71,65.15 v75.87,65.15 82.47,65.15 84.76,62.87 91.11,62.87 | v125.4,48.89 122.86,48.89 121.59,50.16 v121.59,54.23 v91.75,54.23 91.75,56.01 90.98,56.77 90.98,62.74 91.11,62.87 | 91.11,62.87 98.09,62.87 99.36,64.13 99.36,66.04 101.91,68.58 101.91,69.79 R59.2 | R60.1 101.99,71.82 VT3.2
  Bottom 0.61: 66.98,65.15 Q2.E | 77.14,65.15 Q1.E | 56.82,65.15 Q3.E | 46.66,65.15 Q4.E | 46.66,65.15 R16.2 46.66,64.83 C4.1 | 36.5,65.15 Q5.E | 36.5,65.15 R22.2 36.5,64.83 C5.1 | Q6.E 26.34,65.15 R27.2 | Q7.E 16.18,65.15 R32.2 | R32.2 v14.91,65.15 | v25.07,65.15 R27.2 | v35.23,65.15 36.5,65.15 | v45.39,65.15 46.66,65.15 | v55.55,65.15 56.82,65.15 | v65.71,65.15 66.98,65.15 | v75.87,65.15 77.14,65.15 | C7.1 16.18,64.83 R32.2 | C6.1 26.34,64.83 R27.2 | 56.82,64.77 C3.1 | 56.82,64.77 56.82,64.83 R11.2 | 56.82,65.15 56.82,64.77 | 66.98,64.77 C2.1 | 66.98,64.77 66.98,64.83 R6.2 | 66.98,65.15 66.98,64.77 | 77.14,64.77 C1.1 | 77.14,64.77 77.14,64.83 R1.2 | 77.14,65.15 77.14,64.77 | 212.03,114.3 212.03,112.76 210.49,111.21 v210.49,88.9 | 212.03,114.3 v212.03,128.31 | 212.03,114.3 v214.3,114.3
  Bottom 0.813: X14.24 X14.23 121.59,55.88 | X9.9 X9.10 v125.4,48.89 | X11.9 X11.10 103.81,48.26 97.97,54.1 97.97,54.23 v91.75,54.23 | X20.1 150.16,58.42 149.4,59.18 C8.+ 144.45,59.18 143.69,58.42 C9.2 129.84,58.42 127.31,55.88 121.59,55.88 | v121.59,54.23 121.59,55.88
/IN1
  Bottom 0.61: X1.2 82.18,34.25 R4.1
/IN2
  Bottom 0.61: X2.2 72.02,34.25 R9.1
/IN3
  Bottom 0.61: X3.2 61.86,34.25 R14.1
/IN4
  Bottom 0.61: X4.2 51.7,34.25 R19.1
/IN5
  Bottom 0.61: X5.2 41.54,34.25 R25.1
/IN6
  Bottom 0.61: X6.2 31.38,34.25 R30.1
/IN7
  Bottom 0.61: X7.2 21.22,34.25 R35.1
COORD+
  Bottom 0.61: X14.15 111.43,52.7 112.7,51.44 126.15,51.44 R63.1
COORD-
  Bottom 0.61: X14.17 113.97,53.97 115.24,52.7 122.34,52.7 123.56,53.93 R64.1
ENC_0
  Bottom 0.61: X14.13 108.89,46.36 110.8,44.45 X9.2
ENC_A
  Bottom 0.61: X14.9 103.81,51.44 105.72,49.53 105.72,44.45 108.25,41.91 X9.1
ENC_B
  Bottom 0.406: 113.34,43.18 116.51,43.18
  Bottom 0.61: X14.11 106.35,51.44 107.62,50.16 107.62,45.09 109.53,43.18 113.34,43.18 | 116.51,43.18 X9.3
GND  (via drill 0.6 pad 1.42)  (1 unrouted)
  Top 0.61: v124.13,88.9 126.16,88.9 | 126.16,88.9 v141.91,88.9 143.18,88.9 143.97,88.11 VD10.C | VD9.C 126.19,88.87 126.16,88.9 | 108.38,88.9 108.41,88.87 | 72.82,88.9 72.85,88.87 | 90.6,88.9 90.63,88.87 | 55.04,88.9 55.07,88.87 | 37.29,88.87 37.26,88.9 | 19.48,88.9 19.51,88.87 | 92.95,80.26 C13.2 | 90.63,81.38 90.53,81.28 | 91.69,69.89 VT1.2 | 91.69,69.89 IC1.1 | 91.69,69.89 R56.1 | VT2.2 91.68,65.98 91.68,65.97 | SV1.21 SV1.22
  Top 0.813: v17.45,88.9 19.48,88.9 v35.23,88.9 37.26,88.9 v53.01,88.9 55.04,88.9 v70.79,88.9 72.82,88.9 v88.57,88.9 90.6,88.9 v106.35,88.9 108.38,88.9 v124.13,88.9 | 108.41,88.87 VD8.C 108.41,83.44 108.51,83.34 | 72.85,88.87 VD6.C | 90.63,88.87 VD7.C 90.63,81.38 91.75,80.26 92.95,80.26 | 55.07,88.87 VD5.C | 37.29,88.87 VD4.C 37.29,76.68 43.48,70.48 v43.48,63.63 | 19.51,88.87 VD3.C | v138.1,49.53 136.83,49.53 135.56,50.8 v135.56,63.5 | 90.53,81.28 87.3,81.28 84.12,78.1 84.12,66.67 85.39,65.41 91.11,65.41 91.68,65.97 R56.1 | 108.51,83.34 C14.- | 108.51,83.34 109.16,83.34 DZ1.A | C13.2 C12.1 C15.1
  Bottom 0.61: K8.2 139.75,92.33 140.64,91.44 D15.A v141.91,88.9 | K7.2 121.97,92.33 122.86,91.44 D14.A v124.13,88.9 | K6.2 104.19,92.33 105.08,91.44 D13.A v106.35,88.9 | K5.2 86.41,92.33 87.3,91.44 D12.A v88.57,88.9 88.57,87 91.11,84.45 97.46,84.45 99.24,86.23 R61.1 | K4.2 68.63,92.33 69.52,91.44 D11.A v70.79,88.9 | K3.2 50.85,92.33 51.74,91.44 D10.A v53.01,88.9 | K2.2 33.07,92.33 33.96,91.44 D9.A v35.23,88.9 | K1.2 15.29,92.33 16.18,91.44 D8.A v17.45,88.9 | R21.1 44.12,67.18 43.48,66.55 v43.48,63.63 | R26.1 41.64,56.26 | DZ2.A 136.84,36.4 136.85,36.39
  Bottom 0.813: R5.1 OK1.4 82.22,50.8 | R10.1 OK2.4 72.06,50.8 | R15.1 OK3.4 61.9,50.8 | R20.1 OK4.4 51.74,50.8 | R26.1 OK5.4 41.58,50.8 | R31.1 OK6.4 31.42,50.8 | R36.1 OK7.4 21.26,52.07 22.53,50.8 31.42,50.8 | v43.48,63.63 43.48,56.9 42.85,56.26 41.64,56.26 | 31.42,50.8 41.58,50.8 | 41.58,50.8 51.74,50.8 | 51.74,50.8 61.9,50.8 | 61.9,50.8 72.06,50.8 | 72.06,50.8 82.22,50.8 | X14.25 X14.26 124.13,62.23 125.4,63.5 v135.56,63.5 C9.1 143.69,63.5 144.32,62.87 146.86,62.87 C8.- 149.28,62.74 150.04,63.5 X20.2 | X9.6 X9.5 120.32,39.37 | 120.32,39.37 100,39.37 98.73,40.64 X11.5 X11.6 98.73,48.89 96.83,50.8 82.22,50.8 | v138.1,49.53 141.91,45.72 X18.6 X18.5 141.91,36.4 | DZ2.A 141.91,36.4 | 141.91,36.4 DZ3.A DZ4.A | 120.32,39.37 129.13,39.37 132.16,36.33 136.79,36.33 136.85,36.39
  pour Bottom (isolate 0.61, hatched): 188.67,143.86 238.67,143.86 238.67,12.86 188.67,12.86
  pour Top (isolate 0.61, hatched): 188.67,143.86 238.67,143.86 238.67,12.86 188.67,12.86
I0  (via drill 0.6 pad 1.42)
  Top 0.61: SV1.2 202.86,83.83 v203.47,83.82 | v203.47,104.14 210.49,104.14 220.65,114.3 228.24,114.3 X21.11
  Bottom 0.61: v203.47,83.82 v203.47,104.14
I1  (via drill 0.6 pad 1.42)
  Top 0.406: 196.52,87.63 199.06,87.63
  Top 0.61: SV1.3 196.52,87.63 | 199.06,87.63 v201.6,87.63 | v201.6,102.87 211.76,102.87 220.65,111.76 228.24,111.76 X21.9
  Bottom 0.61: v201.6,87.63 v201.6,102.87
I2  (via drill 0.6 pad 1.42)
  Top 0.406: 227,110.49 229.54,110.49
  Top 0.61: SV1.4 204.13,86.37 v205.41,85.09 | v205.41,101.6 213.03,101.6 221.92,110.49 227,110.49 | 229.54,110.49 229.55,110.49 X21.10
  Bottom 0.61: v205.41,85.09 v205.41,101.6
I3  (via drill 0.6 pad 1.42)
  Top 0.61: SV1.5 192.72,88.91 191.44,87.63 191.44,69.85 202.87,58.42 v214.3,58.42
  Bottom 0.61: v214.3,58.42 216.84,55.88 216.84,52.52 SW2.2
I4  (via drill 0.6 pad 1.42)
  Top 0.61: SV1.6 204.13,88.91 206.68,86.36 v215.57,86.36
  Bottom 0.61: v215.57,86.36 216.84,85.09 216.84,82.53 SW1.2
I5  (via drill 0.6 pad 1.42)
  Top 0.61: SV1.7 191.45,91.45 190.17,90.17 190.17,27.94 200.33,17.78 v215.57,17.78
  Bottom 0.61: v215.57,17.78 216.84,19.05 216.84,22.43 SW3.2
I6
  Top 0.61: SV1.8 215.58,91.45 225.73,101.6 228.24,101.6 X21.1
I7
  Top 0.406: 196.52,95.25 199.06,95.25 | 227,102.87 229.54,102.87
  Top 0.61: SV1.9 196.52,95.25 | 199.06,95.25 216.84,95.25 224.46,102.87 227,102.87 | 229.54,102.87 229.54,102.84 X21.2
I8  (via drill 0.6 pad 1.42)
  Top 0.61: SV1.10 202.86,93.99 v215.57,93.98 | v220.65,93.98 228.27,93.98 233.35,99.06 233.35,102.87 232.08,104.14 230.82,104.14 X21.4
  Bottom 0.61: v215.57,93.98 v220.65,93.98
I9
  Top 0.61: SV1.12 215.58,96.53 223.19,104.14 228.24,104.14 X21.3
I10
  Top 0.406: 196.52,100.33 199.06,100.33
  Top 0.61: SV1.13 196.52,100.33 | 199.06,100.33 214.3,100.33 220.65,106.68 228.24,106.68 X21.5
I11
  Top 0.406: 227,105.41 229.54,105.41
  Top 0.61: SV1.14 215.58,99.07 221.92,105.41 227,105.41 | 229.54,105.41 229.55,105.41 X21.6
IN1
  Bottom 0.61: X1.1 77.18,34.25 R2.1
IN2
  Bottom 0.61: X2.1 67.02,34.25 R7.1
IN3
  Bottom 0.61: X3.1 56.86,34.25 R12.1
IN4
  Bottom 0.61: X4.1 46.7,34.25 R17.1
IN5
  Bottom 0.61: X5.1 36.54,34.25 R23.1
IN6
  Bottom 0.61: 26.38,34.25 R28.1
  Bottom 0.813: X6.1 26.38,34.25
IN7
  Bottom 0.61: X7.1 16.22,34.25 R33.1
K1
  Bottom 0.61: D8.C 26.34,91.44 | R37.2 D8.C | X14.12 106.35,77.47 105.08,78.74 101.27,78.74 100.64,79.38 86.03,79.38 82.86,82.55 53.01,82.55 51.74,83.82 36.5,83.82 28.88,91.44 27.1,91.44 | D8.C 27.1,91.44 | K1.1 27.23,91.57 27.1,91.44
K2
  Bottom 0.61: D9.C 44.12,91.44 | R38.2 D9.C | X14.14 108.89,78.74 107.62,80.01 102.54,80.01 101.91,80.64 87.3,80.64 84.12,83.82 54.28,83.82 46.66,91.44 44.88,91.44 | D9.C 44.88,91.44 | K2.1 45.01,91.57 44.88,91.44
K3
  Bottom 0.61: D10.C 61.9,91.44 | R39.2 D10.C | X14.18 113.97,80.01 112.7,81.28 103.81,81.28 103.17,81.91 88.57,81.91 85.39,85.09 72.06,85.09 65.71,91.44 62.79,91.44 | D10.C 62.79,91.44 | 62.79,91.44 K3.1
K4
  Bottom 0.406: 115.24,62.23 115.24,59.69
  Bottom 0.61: D11.C 79.68,91.44 | R40.2 D11.C | 115.24,59.69 X14.19 | 115.24,62.23 115.24,81.28 113.97,82.55 105.08,82.55 104.45,83.19 89.84,83.19 81.59,91.44 80.57,91.44 | D11.C 80.57,91.44 | 80.57,91.44 K4.1
K5
  Bottom 0.61: D12.C 97.46,91.44 | D12.C R41.2 | X14.20 116.51,82.55 115.24,83.82 107.62,83.82 100,91.44 98.73,91.44 | 98.73,91.44 D12.C | K5.1 98.35,91.82 98.73,91.44
K6
  Bottom 0.406: 117.78,59.69 117.78,62.23
  Bottom 0.61: D13.C 115.24,91.44 | D13.C R42.2 | 117.78,59.69 X14.21 | 117.78,62.23 117.78,90.17 116.51,91.44 | 116.51,91.44 D13.C | K6.1 116.13,91.82 116.51,91.44
K7
  Bottom 0.61: K7.1 133.91,92.33 133.02,91.44 D14.C | D14.C R43.2 | X14.22 119.05,83.82 121.59,86.36 127.94,86.36 129.21,87.63 129.21,90.17 130.48,91.44 D14.C
K8  (via drill 0.6 pad 1.42)
  Top 0.61: v101.27,65.41 v121.59,65.41
  Bottom 0.61: K8.1 151.69,92.33 150.8,91.44 D15.C | D15.C R44.2 | X14.8 v101.27,65.41 | v121.59,65.41 121.59,82.55 122.86,83.82 142.54,83.82 146.35,87.63 146.35,90.8 146.99,91.44 D15.C
LIMIT1
  Bottom 0.61: Q1.C R5.2 83.81,58.1 84.76,57.15 84.76,53.34 85.39,52.7 87.94,52.7 88.57,53.34 88.57,57.15 89.84,58.42 X14.1
LIMIT2
  Bottom 0.61: R10.2 Q2.C 72.06,70.48 73.97,72.39 92.38,72.39 93.65,71.12 X14.2
LIMIT3
  Bottom 0.406: 94.92,62.23 94.92,59.69
  Bottom 0.61: R15.2 Q3.C 61.9,71.75 63.81,73.66 93.65,73.66 94.92,72.39 94.92,62.23 | 94.92,59.69 X14.3
N$1
  Bottom 0.61: D1.C 77.98,39.8 77.14,40.64 R2.2 OK1.1
N$2
  Bottom 0.61: D2.C 67.82,39.8 66.98,40.64 R7.2 OK2.1
N$3
  Bottom 0.61: OK1.5 R3.1
N$4
  Bottom 0.61: OK5.1 R23.2 36.5,40.64 37.34,39.8 D5.C
N$5
  Bottom 0.61: OK2.5 R8.1
N$6
  Bottom 0.61: Q1.B 79.68,65.15 R1.1 79.68,64.83 R47.2
N$7
  Bottom 0.61: R48.2 69.52,65.15 | 69.52,65.15 Q2.B | 69.52,65.15 R6.1
N$8
  Bottom 0.61: D3.C 57.66,39.8 56.82,40.64 R12.2 OK3.1
N$9
  Bottom 0.61: OK3.5 R13.1
N$10
  Bottom 0.61: Q3.B 59.36,65.15 R11.1 59.36,64.83 R49.2
N$11
  Bottom 0.61: OK4.1 R17.2 46.66,40.64 47.5,39.8 D4.C
N$12
  Bottom 0.61: OK4.5 R18.1
N$13
  Bottom 0.61: Q4.B 49.2,65.15 R16.1 49.2,64.83 R50.2
N$14
  Bottom 0.61: OK5.5 R24.1
N$15
  Bottom 0.61: Q5.B 39.04,65.15 R22.1 39.04,64.83 R51.2
N$16
  Bottom 1.016: K1.S 27.23,118.49 26.34,119.38 X8.1
N$17
  Bottom 1.016: K1.O 15.29,118.49 16.18,119.38 X8.3
N$18
  Bottom 1.016: K1.P X8.2
N$19
  Bottom 1.016: K2.O 33.07,118.49 33.96,119.38 X10.3
N$20
  Bottom 1.016: K2.S 45.01,118.49 44.12,119.38 X10.1
N$21
  Bottom 1.016: K2.P X10.2
N$22
  Bottom 1.016: K3.O 50.85,118.49 51.74,119.38 X12.3
N$23
  Bottom 1.016: K3.S 62.79,118.49 61.9,119.38 X12.1
N$24
  Bottom 1.016: K3.P X12.2
N$25
  Bottom 1.016: K6.O 104.19,118.49 105.08,119.38 X16.3
N$26
  Bottom 1.016: K6.S 116.13,118.49 115.24,119.38 X16.1
N$27
  Bottom 1.016: K5.P X15.2
N$28
  Bottom 1.016: K5.O 86.41,118.49 87.3,119.38 X15.3
N$29
  Bottom 1.016: K5.S 98.35,118.49 97.46,119.38 X15.1
N$30
  Bottom 1.016: K6.P X16.2
N$31
  Bottom 1.016: K7.O 121.97,118.49 122.86,119.38 X17.3
N$32
  Bottom 1.016: K7.S 133.91,118.49 133.02,119.38 X17.1
N$33
  Bottom 1.016: K7.P X17.2
N$34
  Bottom 1.016: K8.O 139.75,118.49 140.64,119.38 X19.3
N$35
  Bottom 1.016: K8.S 151.69,118.49 150.8,119.38 X19.1
N$36
  Bottom 1.016: K8.P X19.2
N$37
  Bottom 0.61: OK6.1 R28.2 26.34,40.64 27.18,39.8 D6.C
N$38
  Bottom 0.61: OK6.5 R29.1
N$39
  Bottom 0.61: Q6.B 28.88,65.15 R27.1 28.88,64.83 R52.2
N$40
  Bottom 0.61: OK7.1 R33.2 16.18,40.64 17.02,39.8 D7.C
N$41
  Bottom 0.61: OK7.5 R34.1
N$42
  Bottom 0.61: Q7.B 18.72,65.15 R32.1 18.72,64.83 R53.2
N$43
  Bottom 1.016: K4.O 68.63,118.49 69.52,119.38 X13.3
N$44
  Bottom 1.016: K4.S 80.57,118.49 79.68,119.38 X13.1
N$45
  Bottom 1.016: K4.P X13.2
N$46  (via drill 0.6)
  Top 0.61: R46.1 v207.14,79.79
  Bottom 0.61: 210.77,44.45 SW3.1 | 210.77,44.45 210.77,52.45 SW2.1 | SW1.1 208.37,82.5 207.14,81.27 v207.14,79.79 | R46.1 207.17,65.55 210.49,62.23 216.84,62.23 220.65,58.42 220.65,46.99 218.11,44.45 210.77,44.45
N$47  (via drill 0.6 pad 1.42)
  Top 0.61: VD3.A v25.07,86.36
  Bottom 0.61: v25.07,86.36 R37.1
N$48  (via drill 0.6 pad 1.42)
  Top 0.61: VD4.A v42.85,86.36
  Bottom 0.61: v42.85,86.36 R38.1
N$49  (via drill 0.6 pad 1.42)
  Top 0.61: VD5.A v60.63,86.36
  Bottom 0.61: v60.63,86.36 R39.1
N$50  (via drill 0.6 pad 1.42)
  Top 0.61: VD6.A v78.41,86.36
  Bottom 0.61: v78.41,86.36 R40.1
N$51  (via drill 0.6 pad 1.42)
  Top 0.61: VD7.A v96.19,86.36
  Bottom 0.61: v96.19,86.36 R41.1
N$52  (via drill 0.6 pad 1.42)
  Top 0.61: VD8.A v113.97,86.36
  Bottom 0.61: v113.97,86.36 R42.1
N$53  (via drill 0.6 pad 1.42)
  Top 0.61: VD9.A v131.75,86.36
  Bottom 0.61: v131.75,86.36 R43.1
N$54  (via drill 0.6 pad 1.42)
  Top 0.61: VD10.A v149.53,86.36
  Bottom 0.61: v149.53,86.36 R44.1
N$55
  Bottom 0.61: D1.A 81.38,39.8 82.22,40.64 R4.2 80.95,41.91 79.68,43.18 OK1.2
N$56
  Bottom 0.61: D2.A 71.22,39.8 72.06,40.64 R9.2 70.79,41.91 69.52,43.18 OK2.2
N$57
  Bottom 0.61: D3.A 61.06,39.8 61.9,40.64 R14.2 60.63,41.91 59.36,43.18 OK3.2
N$58
  Bottom 0.61: D4.A 50.47,39.37 51.74,40.64 R19.2 50.47,41.91 49.2,43.18 OK4.2
N$59
  Bottom 0.61: D5.A 40.74,39.8 41.58,40.64 R25.2 40.31,41.91 39.04,43.18 OK5.2
N$60
  Bottom 0.61: D6.A 30.58,39.8 31.42,40.64 R30.2 30.15,41.91 28.88,43.18 OK6.2
N$61
  Bottom 0.61: D7.A 20.42,39.8 21.26,40.64 R35.2 19.99,41.91 18.72,43.18 OK7.2
N$62
  Bottom 0.61: C1.2 R47.1 R3.2
N$63
  Bottom 0.61: C2.2 R48.1 R8.2
N$64
  Bottom 0.61: C3.2 R49.1 R13.2
N$65
  Bottom 0.61: C4.2 R50.1 R18.2
N$66
  Bottom 0.61: C6.2 R52.1 R29.2
N$67
  Bottom 0.61: C5.2 R51.1 R24.2
N$68
  Bottom 0.61: C7.2 R53.1 R34.2
N$69
  Top 0.61: IC1.6 IC1.7 C13.1 R54.2
N$70
  Top 0.61: R54.1 89.91,76.45 90.98,76.45 91.34,76.1 IC1.8 91.75,74.04 91.68,73.97 R55.2 95.56,73.97 | 95.56,73.97 97.14,73.97 98.09,74.93 C15.2 101.71,78.42 102.16,77.98 104.41,77.98 C14.+ 108.09,77.94 108.51,78.36 110.75,78.36 DZ1.C R60.2 | 95.56,73.97 IC1.4
N$71  (via drill 0.6 pad 1.42)
  Top 0.61: VT1.1 85.78,69.83 85.78,68.71 86.67,67.82 v86.67,67.31 R56.2
  Bottom 0.61: R57.1 v86.67,67.31
N$72
  Top 0.61: IC1.2 93.02,71.37 92.25,72.14 89.9,72.14 R55.1 89.82,72.09 VT1.3
N$73
  Top 0.61: IC1.5 C12.2
N$74
  Top 0.61: IC1.3 94.28,67.92 VT2.1
N$75
  Top 0.61: VT2.3 97.33,66.93 97.97,67.56 R58.2
N$76
  Top 0.61: R58.1 100.05,71.82 VT3.1 R59.1
N$77
  Bottom 0.61: DZ2.C X18.1 131.75,41.91 129.21,44.45 129.21,48.26 127.32,50.15 123.33,50.14 122.08,48.88 R62.2
N$78
  Bottom 0.406: 143.18,45.72 143.18,43.18
  Bottom 0.61: DZ3.C X18.7 143.18,43.18 | R63.2 140,51.44 143.18,48.26 143.18,45.72
N$79
  Bottom 0.406: 145.72,45.72 145.72,43.18
  Bottom 0.61: DZ4.C X18.9 145.72,43.18 | R64.2 140.08,53.93 141.31,52.71 141.31,52.67 145.72,48.26 145.72,45.72
O2
  Top 0.406: 196.52,118.11 199.06,118.11 | 227,120.65 229.54,120.65
  Top 0.61: SV1.27 196.52,118.11 | 199.06,118.11 218.11,118.11 220.65,120.65 227,120.65 | 229.54,120.65 229.54,120.62 X21.16
O3
  Top 0.61: SV1.28 219.39,116.85 221.92,119.38 228.24,119.38 X21.15
O4
  Top 0.406: 196.52,120.65 199.06,120.65
  Top 0.61: SV1.29 196.52,120.65 | 199.06,120.65 218.11,120.65 219.38,121.92 228.24,121.92 X21.17
O5  (via drill 0.6 pad 1.42)
  Top 0.61: X21.19 216.86,124.44 v216.84,124.46 | v214.3,119.38 SV1.30
  Bottom 0.61: v216.84,124.46 215.57,124.46 214.3,123.19 v214.3,119.38
O6
  Top 0.406: 196.52,123.19 199.06,123.19 | 227,123.19 229.54,123.19
  Top 0.61: SV1.31 196.52,123.19 | 199.06,123.19 227,123.19 | 229.54,123.19 229.55,123.19 X21.20
O7  (via drill 0.6 pad 1.42)
  Top 0.406: 227,118.11 229.54,118.11
  Top 0.61: X21.14 230.8,116.85 229.54,118.11 | 227,118.11 224.46,118.11 v223.19,116.84 | v216.84,121.92 SV1.32
  Bottom 0.61: v223.19,116.84 219.38,116.84 216.84,119.38 v216.84,121.92
O8
  Top 0.406: 196.52,125.73 199.06,125.73
  Top 0.61: X21.21 214.28,126.98 213.03,125.73 199.06,125.73 | 196.52,125.73 SV1.33
O9
  Top 0.406: 227,125.73 229.54,125.73
  Top 0.61: X21.22 230.79,126.98 229.54,125.73 | 227,125.73 215.57,125.73 214.3,124.46 SV1.34
O10
  Top 0.406: 196.52,128.27 199.05,128.25
  Top 0.61: SV1.35 196.52,128.27 | 199.05,128.25 202.68,128.27 204.52,130.11 204.52,134.62 205.79,135.89 230.81,135.89 233.35,133.35 233.35,123.19 232.08,121.92 230.82,121.92 X21.18
O11  (via drill 0.6 pad 1.42)
  Top 0.406: 227,115.57 229.54,115.57
  Top 0.61: SV1.36 198.16,127.01 v204.14,127.01 | v204.14,115.57 227,115.57 | 229.54,115.57 229.54,115.54 X21.12
  Bottom 0.61: v204.14,115.57 v204.14,127.01
O12
  Top 0.61: SV1.37 193.97,129.55 192.71,130.81 192.71,135.89 193.98,137.16 232.08,137.16 234.62,134.62 234.62,110.49 233.35,109.22 230.82,109.22 X21.8
PEILIO_D1
  Bottom 0.61: R20.2 51.74,60.96 Q4.C 50.9,69.8 VD1.A
PEILIO_D2
  Bottom 0.61: R26.2 41.58,59.69 Q5.C 41.58,71.93 VD2.A
PEILIS
  Bottom 0.61: R21.2 44.12,72.26 44.63,72.77 VD2.C VD1.C 47.5,73.87 48.57,74.93 94.28,74.93 96.19,73.03 X14.4
SPEED++
  Bottom 0.406: 110.16,57.15 110.16,59.69
  Bottom 0.61: 110.16,57.15 110.16,50.16 111.43,48.89 116.97,48.89 R62.1 | 110.16,59.69 X14.16
START1
  Bottom 0.406: 97.46,62.23 97.46,59.69
  Bottom 0.61: R31.2 Q6.C 31.42,74.3 33.33,76.2 94.92,76.2 97.46,73.66 97.46,62.23 | 97.46,59.69 X14.5
START2
  Bottom 0.61: R36.2 Q7.C 21.26,74.3 24.44,77.47 95.56,77.47 98.73,74.3 X14.6
V0/V1  (via drill 0.6 pad 1.42)
  Top 0.61: SV1.40 v201.59,132.09 v201.6,132.08 v201.58,132.08 | v201.58,132.08 | v201.6,111.76 204.13,111.76 R45.1 | 197.81,111.78 v201.58,111.78 | 197.81,111.78 SV1.24 | 195.27,111.78 197.81,111.78
  Bottom 0.61: R45.1 204.14,111.77 | v201.58,132.08 v201.58,111.78 v201.6,111.76
ZERO_OUT
  Bottom 0.61: R57.2 86.67,43.18 87.94,41.91 X11.1
ZERO_PULSE  (via drill 0.6 pad 1.42)
  Top 0.61: v103.81,74.04 101.06,74.04 VT3.3
  Bottom 0.61: X14.10 v103.81,74.04 103.81,74.93 102.67,76.07 R61.2

### Text on the board
Top: K1 | K2 | K3 | K4 | K5 | K6 | K7 | K8 | Control | Power | Control module | Interface module | Interface module | Z-sensor | Encoder | FChanger
Bottom: 20110622 | 20110622